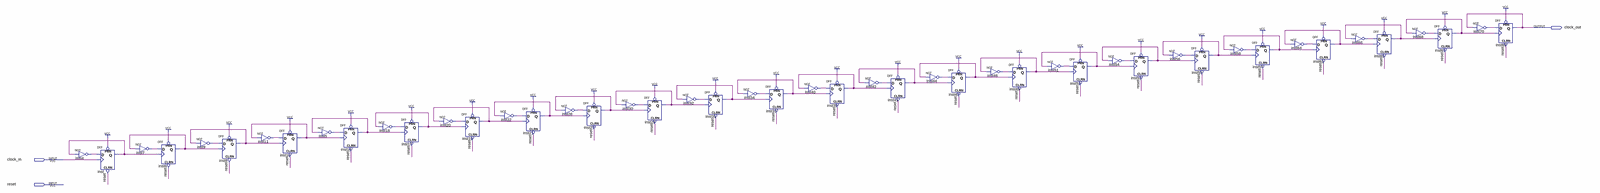
[diagram p0: schematic sheet, whole]
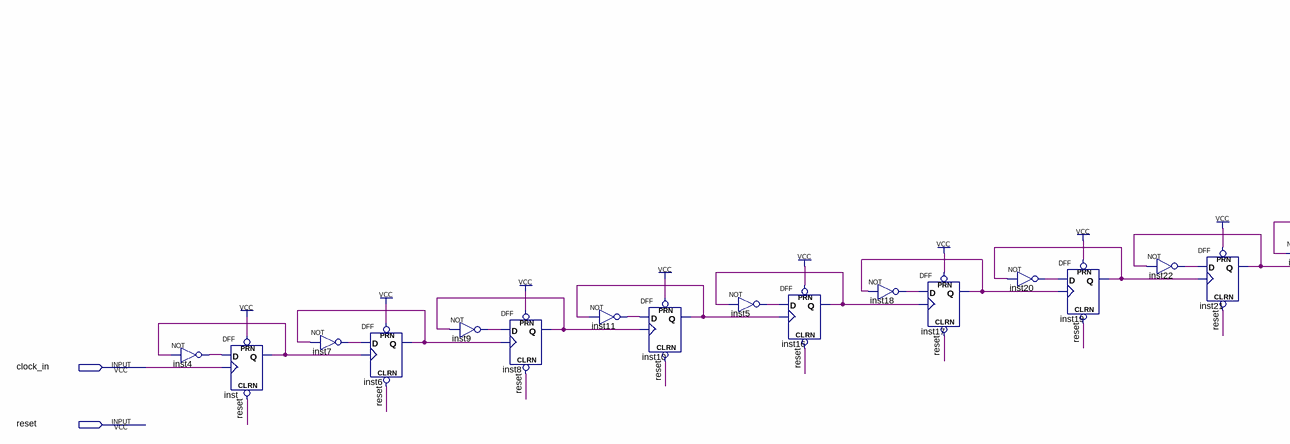
[diagram p1: schematic sheet, left part]
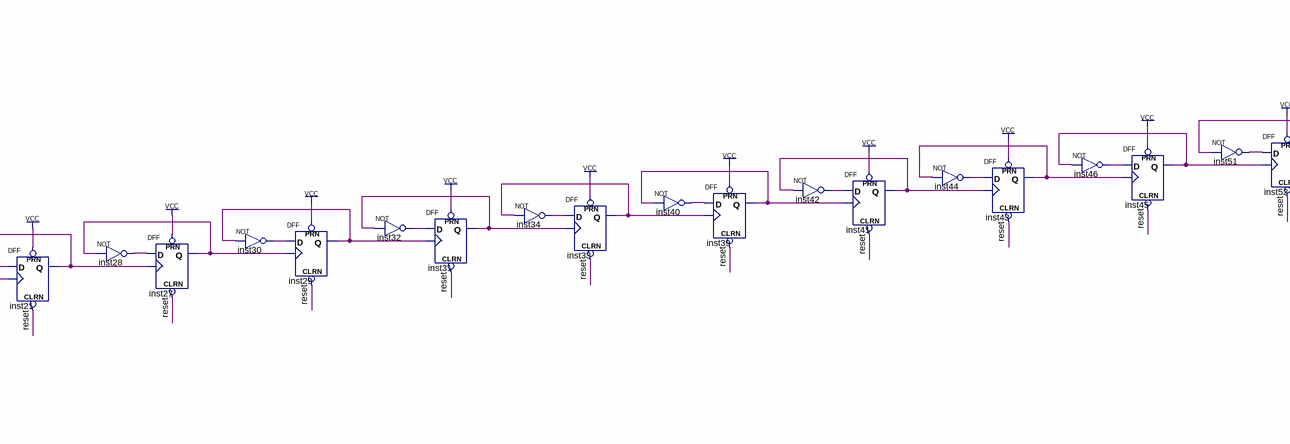
[diagram p2: schematic sheet, centre part]
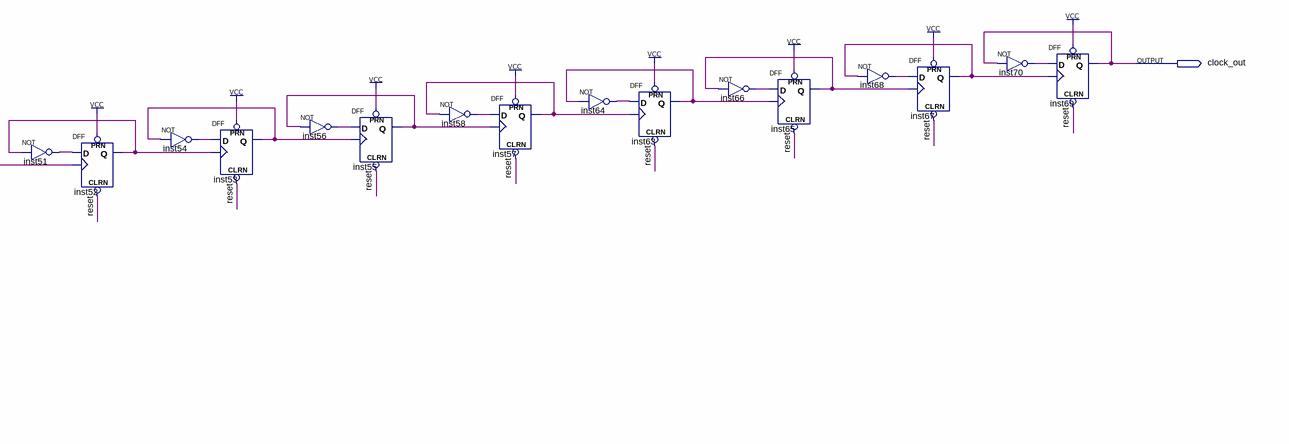
[diagram p3: schematic sheet, right part]
// Quartus schematic LAB05.bdf as structural Verilog: 48 symbols, 3 pins
module LAB05 (
  input  clock_in,
  input  reset,
  output clock_out
);

  wire inst4_out, inst5_out, inst6_q, inst7_out, inst8_q, inst9_out, inst10_q, inst11_out, inst16_q,
       inst17_q, inst18_out, inst19_q, inst20_out, inst21_q, inst22_out, inst27_q, inst28_out, inst29_q,
       inst30_out, inst31_q, inst32_out, inst33_q, inst34_out, inst39_q, inst40_out, inst41_q, inst42_out,
       inst43_q, inst44_out, inst45_q, inst46_out, inst51_out, inst52_q, inst53_q, inst54_out, inst55_q,
       inst56_out, inst57_q, inst58_out, inst63_q, inst64_out, inst65_q, inst66_out, inst67_q, inst68_out,
       inst70_out, inst_q;

  not inst4 (inst4_out, inst_q);
  DFF inst (.CLRN(reset), .CLK(clock_in), .D(inst4_out), .PRN(1'b1), .Q(inst_q));
  not inst7 (inst7_out, inst6_q);
  DFF inst6 (.CLRN(reset), .CLK(inst_q), .D(inst7_out), .PRN(1'b1), .Q(inst6_q));
  not inst9 (inst9_out, inst8_q);
  DFF inst8 (.CLRN(reset), .CLK(inst6_q), .D(inst9_out), .PRN(1'b1), .Q(inst8_q));
  not inst11 (inst11_out, inst10_q);
  DFF inst10 (.CLRN(reset), .CLK(inst8_q), .D(inst11_out), .PRN(1'b1), .Q(inst10_q));
  not inst5 (inst5_out, inst16_q);
  DFF inst16 (.CLRN(reset), .CLK(inst10_q), .D(inst5_out), .PRN(1'b1), .Q(inst16_q));
  not inst18 (inst18_out, inst17_q);
  DFF inst17 (.CLRN(reset), .CLK(inst16_q), .D(inst18_out), .PRN(1'b1), .Q(inst17_q));
  not inst20 (inst20_out, inst19_q);
  DFF inst19 (.CLRN(reset), .CLK(inst17_q), .D(inst20_out), .PRN(1'b1), .Q(inst19_q));
  not inst22 (inst22_out, inst21_q);
  DFF inst21 (.CLRN(reset), .CLK(inst19_q), .D(inst22_out), .PRN(1'b1), .Q(inst21_q));
  not inst28 (inst28_out, inst27_q);
  DFF inst27 (.CLRN(reset), .CLK(inst21_q), .D(inst28_out), .PRN(1'b1), .Q(inst27_q));
  not inst30 (inst30_out, inst29_q);
  DFF inst29 (.CLRN(reset), .CLK(inst27_q), .D(inst30_out), .PRN(1'b1), .Q(inst29_q));
  not inst32 (inst32_out, inst31_q);
  DFF inst31 (.CLRN(reset), .CLK(inst29_q), .D(inst32_out), .PRN(1'b1), .Q(inst31_q));
  not inst34 (inst34_out, inst33_q);
  DFF inst33 (.CLRN(reset), .CLK(inst31_q), .D(inst34_out), .PRN(1'b1), .Q(inst33_q));
  not inst40 (inst40_out, inst39_q);
  DFF inst39 (.CLRN(reset), .CLK(inst33_q), .D(inst40_out), .PRN(1'b1), .Q(inst39_q));
  not inst42 (inst42_out, inst41_q);
  DFF inst41 (.CLRN(reset), .CLK(inst39_q), .D(inst42_out), .PRN(1'b1), .Q(inst41_q));
  not inst44 (inst44_out, inst43_q);
  DFF inst43 (.CLRN(reset), .CLK(inst41_q), .D(inst44_out), .PRN(1'b1), .Q(inst43_q));
  not inst46 (inst46_out, inst45_q);
  DFF inst45 (.CLRN(reset), .CLK(inst43_q), .D(inst46_out), .PRN(1'b1), .Q(inst45_q));
  not inst51 (inst51_out, inst52_q);
  DFF inst52 (.CLRN(reset), .CLK(inst45_q), .D(inst51_out), .PRN(1'b1), .Q(inst52_q));
  not inst54 (inst54_out, inst53_q);
  DFF inst53 (.CLRN(reset), .CLK(inst52_q), .D(inst54_out), .PRN(1'b1), .Q(inst53_q));
  not inst56 (inst56_out, inst55_q);
  DFF inst55 (.CLRN(reset), .CLK(inst53_q), .D(inst56_out), .PRN(1'b1), .Q(inst55_q));
  not inst58 (inst58_out, inst57_q);
  DFF inst57 (.CLRN(reset), .CLK(inst55_q), .D(inst58_out), .PRN(1'b1), .Q(inst57_q));
  not inst64 (inst64_out, inst63_q);
  DFF inst63 (.CLRN(reset), .CLK(inst57_q), .D(inst64_out), .PRN(1'b1), .Q(inst63_q));
  not inst66 (inst66_out, inst65_q);
  DFF inst65 (.CLRN(reset), .CLK(inst63_q), .D(inst66_out), .PRN(1'b1), .Q(inst65_q));
  not inst68 (inst68_out, inst67_q);
  DFF inst67 (.CLRN(reset), .CLK(inst65_q), .D(inst68_out), .PRN(1'b1), .Q(inst67_q));
  not inst70 (inst70_out, clock_out);
  DFF inst69 (.CLRN(reset), .CLK(inst67_q), .D(inst70_out), .PRN(1'b1), .Q(clock_out));
endmodule
